# Altium project Accelerometer_Breakout.PrjPcb
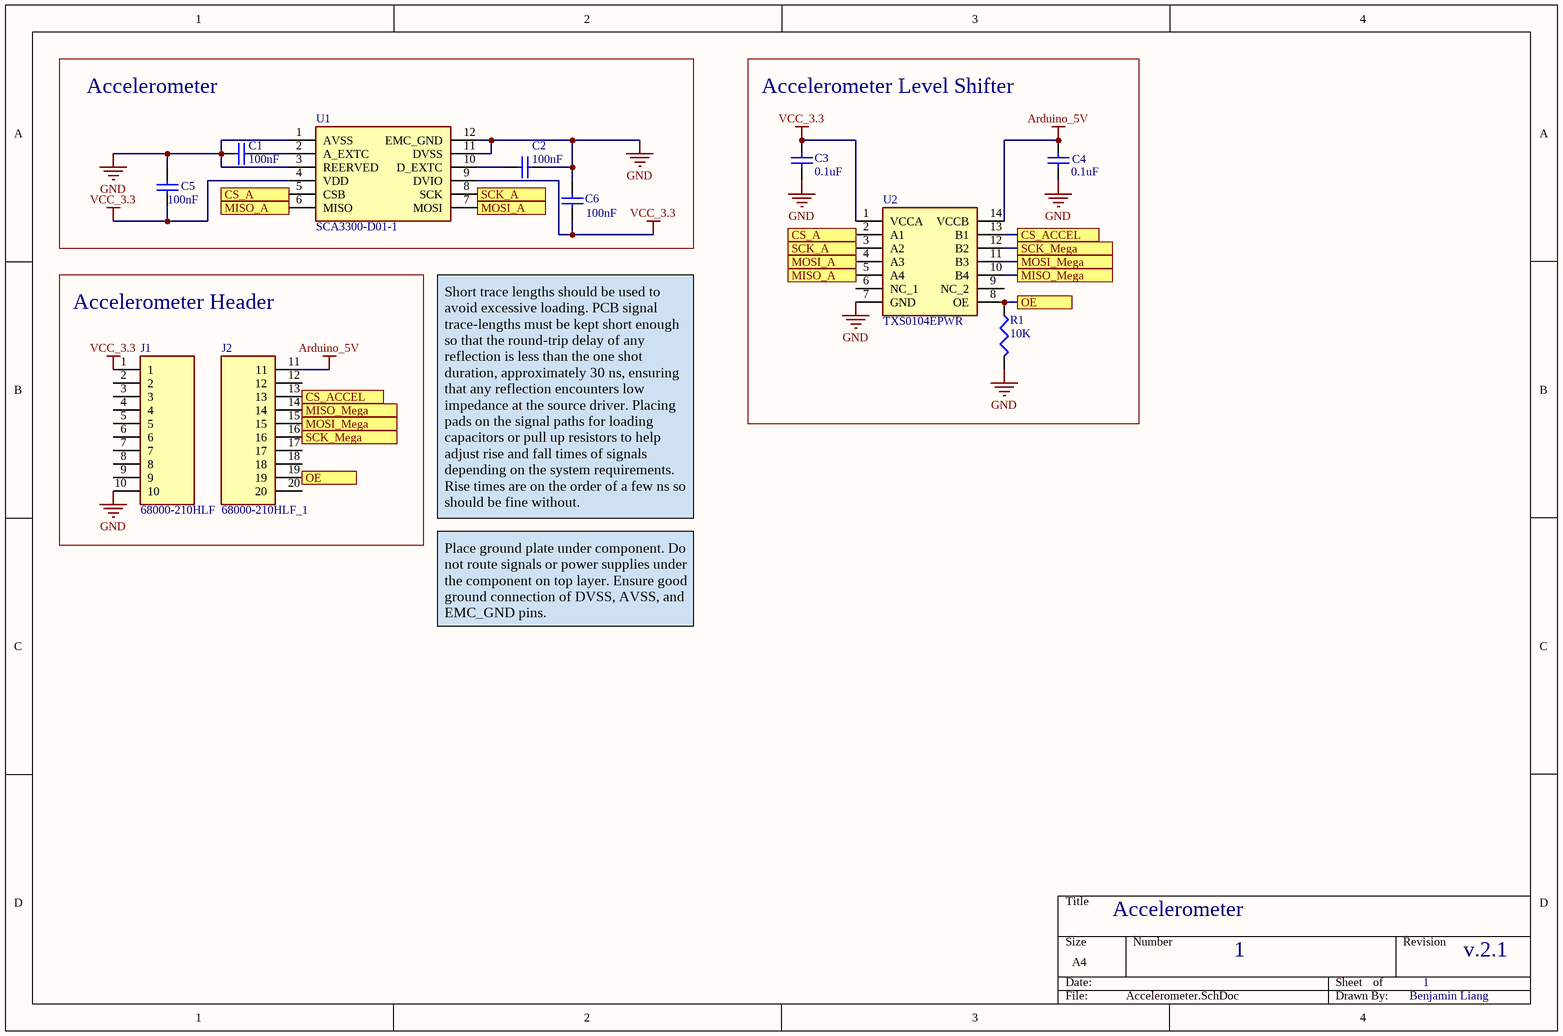
[diagram p0: Accelerometer.SchDoc]
1 sheet, 11 parts. Net scope: flat (ports and power ports of the same name join across sheets).
Board file: Accelerometer.PcbDoc

## Sheet Accelerometer.SchDoc
size A4; SheetNumber: 1; SheetTotal: 1

### Parts
C1  100nF  [C1206]
C2  100nF  [C1206]
C3  0.1uF  [C1206]
C4  0.1uF  [C1206]
C5  100nF  [C1206]
C6  100nF  [C1206]
J1  68000-210HLF  [HDRV10W63P0X254_1X10_2540X241X858P]
J2  68000-210HLF_1  [HDRV10W63P0X254_1X10_2540X241X858P]
R1  10K  [J1-0603]
U1  SCA3300-D01-1  [SCA3300]
U2  TXS0104EPWR  [SOP65P640X120-14N]

### Blocks framed on the sheet
Accelerometer: C1 C2 C5 C6 U1
Accelerometer Level Shifter: C3 C4 R1 U2
Accelerometer Header: J1 J2

### Ports
CS_A, CS_ACCEL, MISO_A, MISO_Mega, MOSI_A, MOSI_Mega, OE, SCK_A, SCK_Mega

### Nets
Arduino_5V: C4.1 J2.11 U2.14(VCCB)
GND: C1.2 C2.1 C3.2 C4.2 C5.1 C6.2 J1.10 R1.2 U1.1(AVSS) U1.3(REERVED) U1.11(DVSS) U1.12(EMC_GND) U2.7(GND)
VCC_3.3: C3.1 C5.2 C6.1 J1.1 U1.4(VDD) U1.9(DVIO) U2.1(VCCA)
NetC1_1: C1.1 U1.2(A_EXTC)
NetC2_2: C2.2 U1.10(D_EXTC)
NetJ2_13: J2.13 U2.13(B1) ; port CS_ACCEL
NetJ2_14: J2.14 U2.10(B4) ; port MISO_Mega
NetJ2_15: J2.15 U2.11(B3) ; port MOSI_Mega
NetJ2_16: J2.16 U2.12(B2) ; port SCK_Mega
NetJ2_19: J2.19 R1.1 U2.8(OE) ; port OE
NetU1_5: U1.5(CSB) U2.2(A1) ; port CS_A
NetU1_6: U1.6(MISO) U2.5(A4) ; port MISO_A
NetU1_7: U1.7(MOSI) U2.4(A3) ; port MOSI_A
NetU1_8: U1.8(SCK) U2.3(A2) ; port SCK_A

Not connected (* = marked no-connect by the designer): J1 2 3 4 5 6 7 8 9; J2 12 17 18 20; U2 6(NC_1) 9(NC_2)

### Notes on the sheet
- Short trace lengths should be used to avoid excessive loading. PCB signal trace-lengths must be kept short enough so that the round-trip delay of any reflection is less than the one shot duration, approximately 30 ns, ensuring that any reflection encounters low impedance at the source driver. Placing pads on the signal paths for loading capacitors or pull up resistors to help adjust rise and fall times of signals depending on the system requirements. Rise times are on the order of a few ns so should be fine without.
- Place ground plate under component. Do not route signals or power supplies under the component on top layer. Ensure good ground connection of DVSS, AVSS, and EMC_GND pins.
- Accelerometer
- 1
- v.2.1
- Benjamin Liang

### Library data of the parts
C1 C2 C5 C6 = Cap Semi: Capacitor (Semiconductor SIM Model); Published: 8-Jun-2000; LatestRevisionDate: 29-May-2009; LatestRevisionNote: IPC-7351 Footprint Added.; PackageReference: C1206; Publisher: Altium Limited; PackageDescription: Chip Capacitor; Value: 100nF
C3 C4 = Cap Semi: Capacitor (Semiconductor SIM Model); Value: 100nF; Published: 8-Jun-2000; LatestRevisionDate: 29-May-2009; LatestRevisionNote: IPC-7351 Footprint Added.; PackageReference: C1206; Publisher: Altium Limited; PackageDescription: Chip Capacitor
J1 = 68000-210HLF: Connector; Manufacturer_Name: Amphenol; Datasheet Link: https://cdn.amphenol-icc.com/media/wysiwyg/files/drawing/68000.pdf; Height: 8.58mm; Manufacturer_Part_Number: 68000-210HLF; Mouser Part Number: 649-68000-210HLF; Mouser Price/Stock: https://www.mouser.co.uk/ProductDetail/Amphenol-FCI/68000-210HLF?qs=QKvFUfBIyQINb7f%2F4SDc2A%3D%3D; Arrow Part Number: 68000-210HLF; Arrow Price/Stock: https://www.arrow.com/en/products/68000-210hlf/amphenol-fci
J2 = 68000-210HLF_1: Connector; Manufacturer_Name: Amphenol; Datasheet Link: https://cdn.amphenol-icc.com/media/wysiwyg/files/drawing/68000.pdf; Height: 8.58mm; Manufacturer_Part_Number: 68000-210HLF; Mouser Part Number: 649-68000-210HLF; Mouser Price/Stock: https://www.mouser.co.uk/ProductDetail/Amphenol-FCI/68000-210HLF?qs=QKvFUfBIyQINb7f%2F4SDc2A%3D%3D; Arrow Part Number: 68000-210HLF; Arrow Price/Stock: https://www.arrow.com/en/products/68000-210hlf/amphenol-fci
R1 = Res3: Resistor; Published: 8-Jun-2000; LatestRevisionDate: 29-May-2009; LatestRevisionNote: IPC-7351 Footprint Added.; PackageReference: J1-0603; Publisher: Altium Limited; PackageDescription: Chip Resistor; Value: 10K
U1 = SCA3300-D01-1: Accelerometer; Manufacturer_Name: Murata Electronics; Datasheet Link: https://datasheet.datasheetarchive.com/originals/distributors/DKDS-31/605263.pdf; Manufacturer_Part_Number: SCA3300-D01-1; Mouser Part Number: 81-SCA3300-D01-1; Mouser Price/Stock: https://www.mouser.co.uk/ProductDetail/Murata-Electronics/SCA3300-D01-1?qs=u4fy%2FsgLU9PJXg1inqbWiw%3D%3D; Arrow Part Number: SCA3300-D01-1; Arrow Price/Stock: https://www.arrow.com/en/products/sca3300-d01-1/murata-manufacturing
U2 = TXS0104EPWR: Integrated Circuit; Manufacturer_Name: Texas Instruments; Datasheet Link: http://www.ti.com/lit/ds/symlink/txs0104e.pdf; Height: 1.2mm; Manufacturer_Part_Number: TXS0104EPWR; Mouser Part Number: 595-TXS0104EPWR; Mouser Price/Stock: https://www.mouser.co.uk/ProductDetail/Texas-Instruments/TXS0104EPWR?qs=7kv20MEVUlglsv2MH6ZndA%3D%3D; Arrow Part Number: TXS0104EPWR; Arrow Price/Stock: https://www.arrow.com/en/products/txs0104epwr/texas-instruments?region=nac